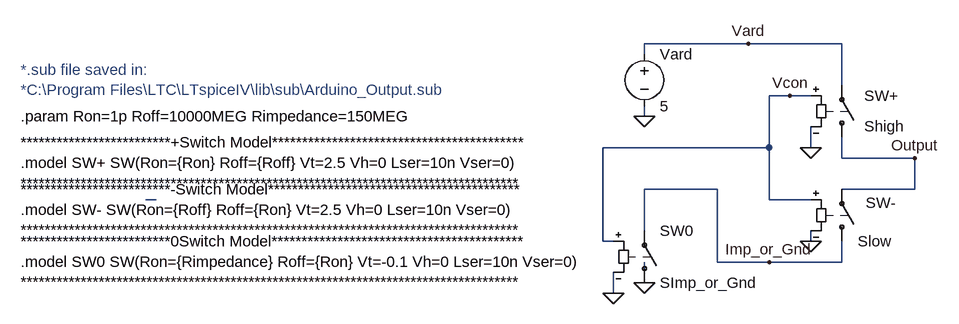
[diagram p0: schematic Arduino_Output.asc]
Arduino_Output.asc, the LTspice schematic file:
Version 4
SHEET 1 1764 680
WIRE 1072 -304 912 -304
WIRE 1216 -304 1072 -304
WIRE 912 -288 912 -304
WIRE 1216 -240 1216 -304
WIRE 1136 -224 1104 -224
WIRE 1168 -224 1136 -224
WIRE 912 -192 912 -208
WIRE 1104 -144 1104 -224
WIRE 1104 -144 848 -144
WIRE 1168 -144 1168 -176
WIRE 1216 -128 1216 -160
WIRE 1328 -128 1216 -128
WIRE 1024 -80 912 -80
WIRE 1328 -80 1328 -128
WIRE 1328 -80 1216 -80
WIRE 160 -64 144 -64
WIRE 1104 -64 1104 -144
WIRE 1168 -64 1104 -64
WIRE 912 -16 912 -80
WIRE 848 0 848 -144
WIRE 864 0 848 0
WIRE 1168 0 1168 -16
WIRE 1024 32 1024 -80
WIRE 1104 32 1024 32
WIRE 1216 32 1216 0
WIRE 1216 32 1104 32
WIRE 912 64 912 32
WIRE 864 80 864 48
FLAG 912 -192 0
FLAG 1168 -144 0
FLAG 1168 0 0
FLAG 1136 -224 Vcon
FLAG 1328 -128 Output
FLAG 912 64 0
FLAG 864 80 0
FLAG 1072 -304 Vard
FLAG 1104 32 Imp_or_Gnd
SYMBOL sw 1216 16 M180
WINDOW 3 37 75 Left 2
SYMATTR Value SW-
SYMATTR InstName Slow
SYMBOL sw 1216 -144 M180
WINDOW 0 34 33 Left 2
WINDOW 3 34 80 Left 2
SYMATTR InstName Shigh
SYMATTR Value SW+
SYMBOL sw 912 80 M180
SYMATTR InstName SImp_or_Gnd
SYMATTR Value SW0
SYMBOL voltage 912 -304 R0
WINDOW 123 0 0 Left 2
WINDOW 39 0 0 Left 2
SYMATTR InstName Vard
SYMATTR Value 5
TEXT -48 -152 Left 2 !*************************+Switch Model******************************************\n.model SW+ SW(Ron={Ron} Roff={Roff} Vt=2.5 Vh=0 Lser=10n Vser=0)\n***********************************************************************************
TEXT -48 -192 Left 2 !.param Ron=1p Roff=10000MEG Rimpedance=150MEG
TEXT -48 -80 Left 2 !*************************-Switch Model******************************************\n.model SW- SW(Ron={Roff} Roff={Ron} Vt=2.5 Vh=0 Lser=10n Vser=0)\n***********************************************************************************
TEXT -48 0 Left 2 !*************************0Switch Model******************************************\n.model SW0 SW(Ron={Rimpedance} Roff={Ron} Vt=-0.1 Vh=0 Lser=10n Vser=0)\n***********************************************************************************
TEXT -48 -264 Left 2 ;*.sub file saved in:\n*C:\\Program Files\\LTC\\LTspiceIV\\lib\\sub\\Arduino_Output.sub

The netlist it stands for:
* Arduino_Output.asc
Slow Imp_or_Gnd Output Vcon 0 SW-
Shigh Output Vard Vcon 0 SW+
SImp_or_Gnd 0 Imp_or_Gnd Vcon 0 SW0
Vard Vard 0 5
*************************+Switch Model******************************************
.model SW+ SW(Ron={Ron} Roff={Roff} Vt=2.5 Vh=0 Lser=10n Vser=0)
***********************************************************************************
.param Ron=1p Roff=10000MEG Rimpedance=150MEG
*************************-Switch Model******************************************
.model SW- SW(Ron={Roff} Roff={Ron} Vt=2.5 Vh=0 Lser=10n Vser=0)
***********************************************************************************
*************************0Switch Model******************************************
.model SW0 SW(Ron={Rimpedance} Roff={Ron} Vt=-0.1 Vh=0 Lser=10n Vser=0)
***********************************************************************************
* *.sub file saved in:
* *C:\Program Files\LTC\LTspiceIV\lib\sub\Arduino_Output.sub
.backanno
.end